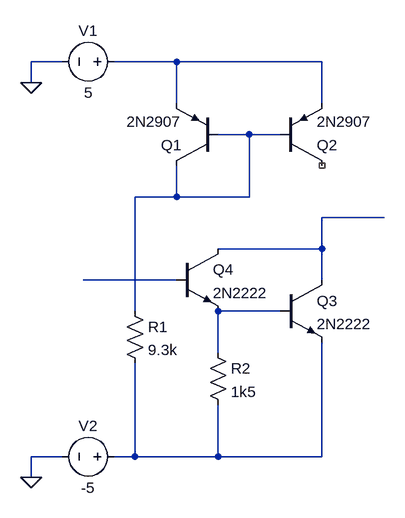
[diagram p0: schematic Draft14.asc]
Draft14.asc, the LTspice schematic file:
Version 4
SHEET 1 880 696
WIRE 128 32 80 32
WIRE 304 32 208 32
WIRE 528 32 304 32
WIRE 80 64 80 32
WIRE 304 96 304 32
WIRE 528 96 528 32
WIRE 416 144 368 144
WIRE 464 144 416 144
WIRE 304 240 304 192
WIRE 304 240 240 240
WIRE 416 240 416 144
WIRE 416 240 304 240
WIRE 624 272 528 272
WIRE 528 320 528 272
WIRE 528 320 368 320
WIRE 304 368 160 368
WIRE 528 368 528 320
WIRE 240 416 240 240
WIRE 464 416 368 416
WIRE 368 480 368 416
WIRE 128 640 80 640
WIRE 240 640 240 496
WIRE 240 640 208 640
WIRE 368 640 368 560
WIRE 368 640 240 640
WIRE 528 640 528 464
WIRE 528 640 368 640
WIRE 80 672 80 640
FLAG 80 64 0
FLAG 80 672 0
SYMBOL voltage 224 32 R90
WINDOW 0 -32 56 VBottom 2
WINDOW 3 32 56 VTop 2
SYMATTR InstName V1
SYMATTR Value 5
SYMBOL pnp 368 192 R180
SYMATTR InstName Q1
SYMATTR Value 2N2907
SYMBOL pnp 464 192 M180
SYMATTR InstName Q2
SYMATTR Value 2N2907
SYMBOL npn 464 368 R0
SYMATTR InstName Q3
SYMATTR Value 2N2222
SYMBOL npn 304 320 R0
SYMATTR InstName Q4
SYMATTR Value 2N2222
SYMBOL voltage 224 640 R90
WINDOW 0 -32 56 VBottom 2
WINDOW 3 32 56 VTop 2
SYMATTR InstName V2
SYMATTR Value -5
SYMBOL res 224 400 R0
SYMATTR InstName R1
SYMATTR Value 9.3k
SYMBOL res 352 464 R0
SYMATTR InstName R2
SYMATTR Value 1k5

The netlist it stands for:
* Draft14.asc
V1 N001 0 5
Q1 N002 N002 N001 0 2N2907
Q2 NC_01 N002 N001 0 2N2907
Q3 N003 N005 N006 0 2N2222
Q4 N003 N004 N005 0 2N2222
V2 N006 0 -5
R1 N002 N006 9.3k
R2 N005 N006 1k5
.model NPN NPN
.model PNP PNP
.lib standard.bjt
.backanno
.end